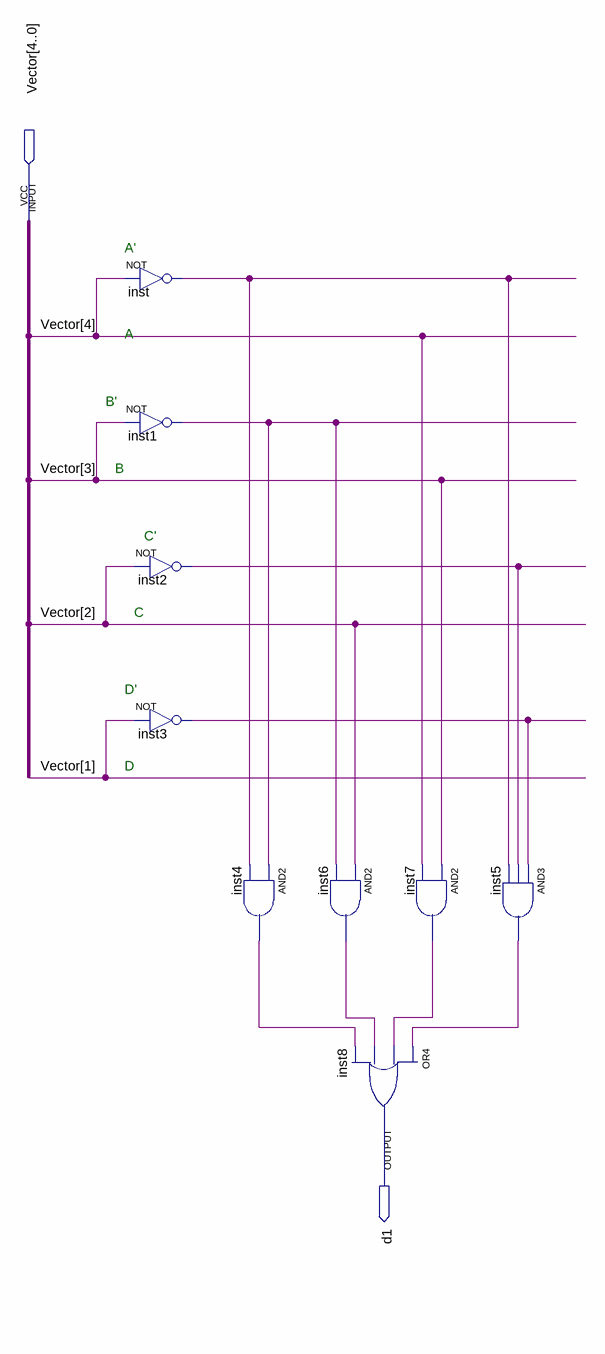
[diagram p0: schematic sheet]
// Quartus schematic d1.bdf as structural Verilog: 9 symbols, 2 pins
module d1 (
  input  [4:0] Vector,
  output d1
);

  wire inst1_out, inst2_out, inst3_out, inst4_out, inst5_out, inst6_out, inst7_out, inst_out;

  not inst (inst_out, Vector[4]);
  not inst1 (inst1_out, Vector[3]);
  not inst2 (inst2_out, Vector[2]);
  not inst3 (inst3_out, Vector[1]);
  and inst4 (inst4_out, inst1_out, inst_out);
  and inst6 (inst6_out, Vector[2], inst1_out);
  or inst8 (d1, inst5_out, inst7_out, inst6_out, inst4_out);
  and inst7 (inst7_out, Vector[3], Vector[4]);
  and inst5 (inst5_out, inst3_out, inst2_out, inst_out);

  // Notes on the sheet:
  //   A'
  //   A
  //   B'
  //   B
  //   C'
  //   C
  //   D'
  //   D
endmodule
